# Altium schematic sheet Ethernet_part.SchDoc
size A4; SheetNumber: 2; SheetTotal: 3
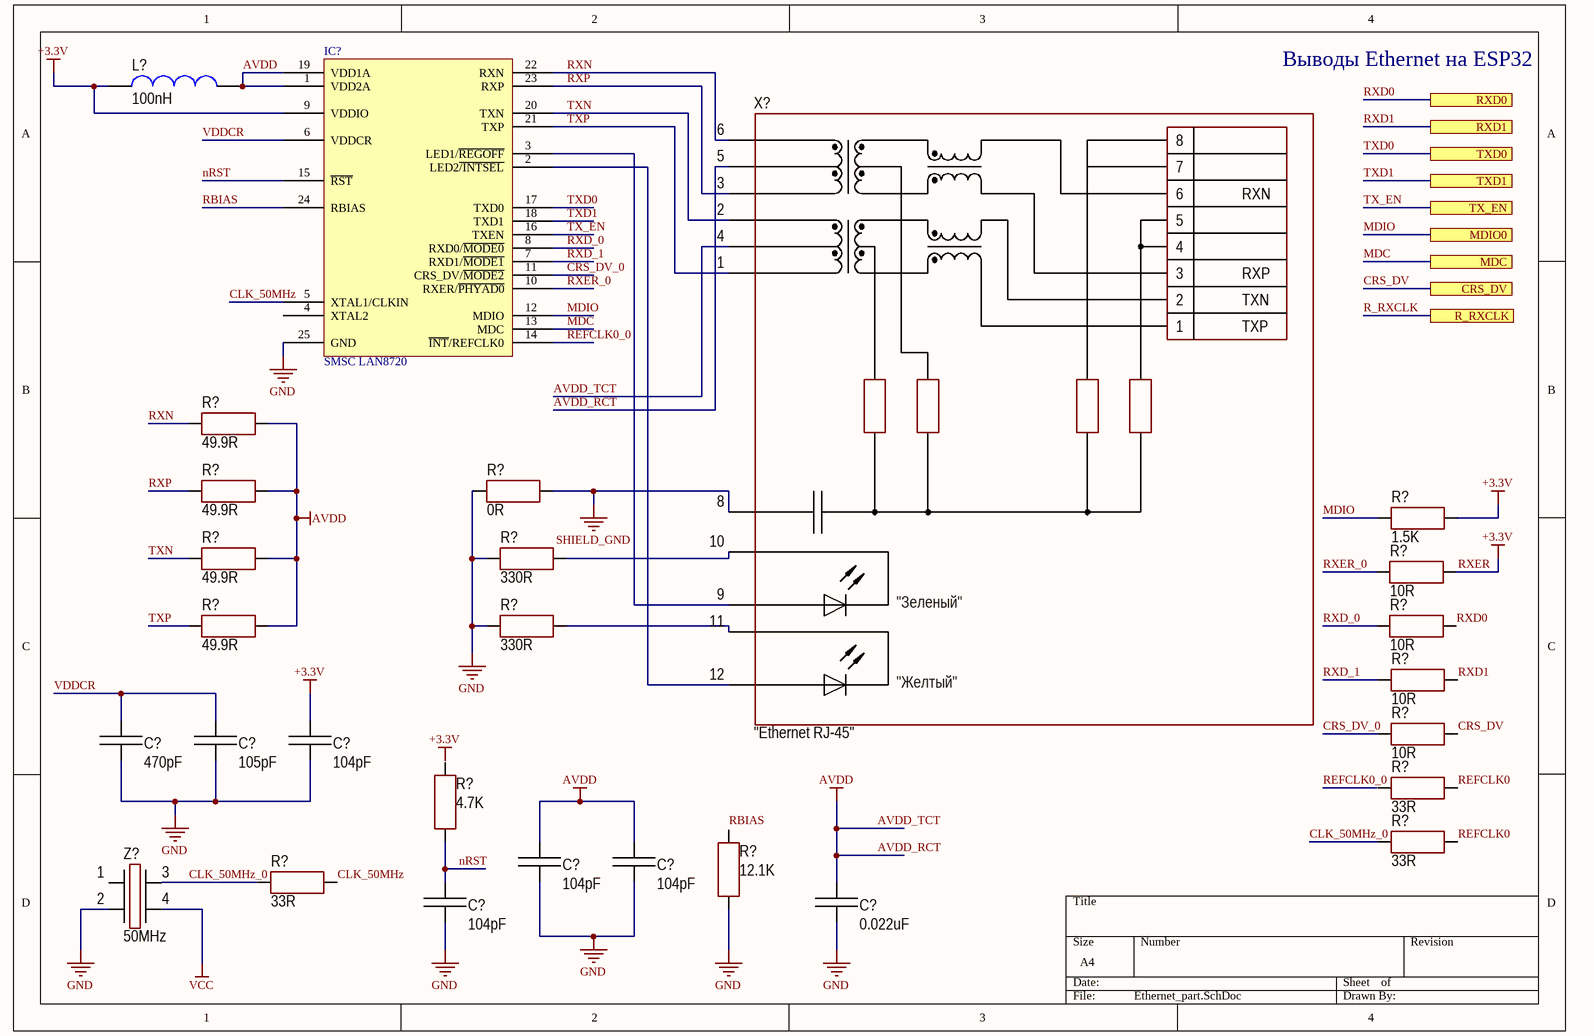
[diagram p0: Ethernet_part.SchDoc]

## Parts
(Parts that share a designator on the sheet are numbered #1, #2 ... from top to bottom, then left to right.)
C?#1  value 470pF  [CAP: 0402]
C?#2  value 105pF  [CAP: 0402]
C?#3  value 104pF  [CAP: 0402]
C?#4  value 104pF  [CAP: 0402]
C?#5  value 104pF  [CAP: 0402]
C?#6  value 104pF  [CAP: 0402]
C?#7  value 0.022uF  [CAP: 0402]
IC?  SMSC LAN8720  [MICROCHIP QFN-24 4x4]
L?  value 100nH  [IND: 0402]
R?#1  value 49.9R  [RES: 0402]
R?#2  value 49.9R  [RES: 0402]
R?#3  value 0R  [RES: 0402]
R?#4  value 1.5K  [RES: 0402]
R?#5  value 49.9R  [RES: 0402]
R?#6  value 330R  [RES: 0402]
R?#7  value 10R  [RES: 0402]
R?#8  value 49.9R  [RES: 0402]
R?#9  value 330R  [RES: 0402]
R?#10  value 10R  [RES: 0402]
R?#11  value 10R  [RES: 0402]
R?#12  value 10R  [RES: 0402]
R?#13  value 4.7K  [RES: 0402]
R?#14  value 33R  [RES: 0402]
R?#15  value 12.1K  [RES: 0402]
R?#16  value 33R  [RES: 0402]
R?#17  value 33R  [RES: 0402]
X?  CommentText: "Ethernet RJ-45"  [CON: HR911105A]
Z?  Frequency: 50MHz  [OSC: 3225]

## Ports
CRS_DV (see esp_part[6D]), MDC (see esp_part[6D]), MDIO0 (see esp_part[6D]), R_RXCLK (see esp_part[6D]), RXD0 (see esp_part[6C]), RXD1 (see esp_part[6C]), TX_EN (see esp_part[6D]), TXD0 (see esp_part[6C]), TXD1 (see esp_part[6D])

## Nets
AVDD: C?#4.2 C?#5.2 C?#7.2 IC?.1(VDD2A) IC?.19(VDD1A) L?.1 R?#1.1 R?#2.1 R?#5.1 R?#8.1 X?.4(CT) X?.5(CT)  [also labelled AVDD_RCT, AVDD_TCT]
GND: C?#3.1 C?#5.1 C?#7.1 IC?.25(GND) R?#3.1 R?#6.1 R?#9.1 R?#15.2 Z?.2
RXER: C?#3.2 IC?.9(VDDIO) L?.2 R?#4.1 R?#7.1  [also labelled +3.3V]
SHIELD_GND: R?#3.2 X?.8(GND)
VCC: Z?.4
CLK_50MHz: IC?.5(XTAL1/CLKIN) R?#17.2
CLK_50MHz_0: R?#16.2 R?#17.1 Z?.3
CRS_DV: R?#12.1 ; port CRS_DV
CRS_DV_0: IC?.11(CRS_DV/~{MODE2}) R?#12.2
MDC: IC?.13(MDC) ; port MDC
MDIO: IC?.12(MDIO) R?#4.2 ; port MDIO0
nRST: C?#6.2 IC?.15(~{RST}) R?#13.2
R_RXCLK: port R_RXCLK
RBIAS: IC?.24(RBIAS)
REFCLK0: R?#14.1 R?#16.1
REFCLK0_0: IC?.14(~{INT}/REFCLK0)
RXD0: R?#10.1 ; port RXD0
RXD1: R?#11.1 ; port RXD1
RXD_0: IC?.8(RXD0/~{MODE0}) R?#10.2
RXD_1: IC?.7(RXD1/~{MODE1}) R?#11.2
RXER_0: IC?.10(RXER/~{PHYAD0}) R?#7.2
RXN: IC?.22(RXN) R?#1.2 X?.6(RD-)
RXP: IC?.23(RXP) R?#2.2 X?.3(RD+)
TX_EN: IC?.16(TXEN) ; port TX_EN
TXD0: IC?.17(TXD0) ; port TXD0
TXD1: IC?.18(TXD1) ; port TXD1
TXN: IC?.20(TXN) R?#5.2 X?.2(TD-)
TXP: IC?.21(TXP) R?#8.2 X?.1(TD+)
VDDCR: C?#1.2 C?#2.2 IC?.6(VDDCR)
NetIC?_2: IC?.2(LED2~{/INTSEL}) X?.12(D4)
NetIC?_3: IC?.3(LED1/~{REGOFF}) X?.9(D2)
NetR?#6_2: R?#6.2 X?.10(D1)
NetR?#9_2: R?#9.2 X?.11(D3)

Not connected (* = marked no-connect by the designer): C?#1 1; C?#2 1; C?#4 1; C?#6 1; IC? 4(XTAL2); R?#13 1; R?#14 2; R?#15 1; Z? 1

## Notes on the sheet
- Выводы Ethernet на ESP32
- Labels drawn without touching a wire or pin: +3.3V, RBIAS
- (in symbol Connector_HR911105A) 7; RXN; RXP; TXN; TXP; "Зеленый"; "Желтый"

## Library data of the parts
C?#1 = Ceramic_0402: Manufacturer: Yageo; PartNumber: CC0402KRX7R7BB104; ValueManufacturerPartNumber: Ceramic capacitor, 470pF, X7R, ±10%, 16V, 0402, -55...+125°C; TypeCapacitor: Ceramic capacitor; Tolerance: ±10%; TypeDielectric: X7R; Voltage: 16V; Package: 0402; HelpURL: https://www.digikey.com/product-detail/en/yageo/CC0402KRX7R7BB104/311-1338-1-ND/2103122; Temperature: -55...+125°C
C?#2 = Ceramic_0402: Manufacturer: Yageo; PartNumber: CC0402KRX7R7BB104; ValueManufacturerPartNumber: Ceramic capacitor, 105pF, X7R, ±10%, 16V, 0402, -55...+125°C; TypeCapacitor: Ceramic capacitor; Tolerance: ±10%; TypeDielectric: X7R; Voltage: 16V; Package: 0402; HelpURL: https://www.digikey.com/product-detail/en/yageo/CC0402KRX7R7BB104/311-1338-1-ND/2103122; Temperature: -55...+125°C
C?#3-C?#6 = Ceramic_0402: Manufacturer: Yageo; PartNumber: CC0402KRX7R7BB104; ValueManufacturerPartNumber: Ceramic capacitor, 104pF, X7R, ±10%, 16V, 0402, -55...+125°C; TypeCapacitor: Ceramic capacitor; Tolerance: ±10%; TypeDielectric: X7R; Voltage: 16V; Package: 0402; HelpURL: https://www.digikey.com/product-detail/en/yageo/CC0402KRX7R7BB104/311-1338-1-ND/2103122; Temperature: -55...+125°C
C?#7 = Ceramic_0402: Manufacturer: Yageo; PartNumber: CC0402KRX7R7BB104; ValueManufacturerPartNumber: Ceramic capacitor, 0.022uF, X7R, ±10%, 16V, 0402, -55...+125°C; TypeCapacitor: Ceramic capacitor; Tolerance: ±10%; TypeDielectric: X7R; Voltage: 16V; Package: 0402; HelpURL: https://www.digikey.com/product-detail/en/yageo/CC0402KRX7R7BB104/311-1338-1-ND/2103122; Temperature: -55...+125°C
IC? = SMSC LAN8720: Small Footprint RMII 10/100 Ethernet  Transceiver with HP Auto-MDIX Support
L? = Inductor_0402: Manufacturer: Murata Electronics; PartNumber: LQG15HSR10J02D; ValueManufacturerPartNumber: Fixed inductor, 100nH, ±5%, 0402, 200mA, -55...+125°C; TypeInductor: Fixed inductor; MaxCurrent: 200mA; Tolerance: ±5%; Package: 0402; HelpURL: https://www.digikey.com/product-detail/en/murata-electronics-north-america/LQG15HSR10J02D/490-2635-1-ND/662915; Temperature: -55...+125°C
R?#1 R?#2 R?#5 R?#8 = Resistor_0402: Manufacturer: Yageo; PartNumber: RC0402JR-07100RL; ValueManufacturerPartNumber: Resistor film, 49.9R, ±5%, 0402, 0.063W, -55...+125°C; TypeResistor: Resistor film; Power: 0.063W; Tolerance: ±5%; Package: 0402; HelpURL: https://www.digikey.com/product-detail/en/yageo/RC0402JR-07100RL/311-100JRCT-ND/729362; Temperature: -55...+125°C
R?#3 = Resistor_0402: Manufacturer: Yageo; PartNumber: RC0402JR-07100RL; ValueManufacturerPartNumber: Resistor film, 0R, ±5%, 0402, 0.063W, -55...+125°C; TypeResistor: Resistor film; Power: 0.063W; Tolerance: ±5%; Package: 0402; HelpURL: https://www.digikey.com/product-detail/en/yageo/RC0402JR-07100RL/311-100JRCT-ND/729362; Temperature: -55...+125°C
R?#4 = Resistor_0402: Manufacturer: Yageo; PartNumber: RC0402JR-07100RL; ValueManufacturerPartNumber: Resistor film, 1.5K, ±5%, 0402, 0.063W, -55...+125°C; TypeResistor: Resistor film; Power: 0.063W; Tolerance: ±5%; Package: 0402; HelpURL: https://www.digikey.com/product-detail/en/yageo/RC0402JR-07100RL/311-100JRCT-ND/729362; Temperature: -55...+125°C
R?#6 R?#9 = Resistor_0402: Manufacturer: Yageo; PartNumber: RC0402JR-07100RL; ValueManufacturerPartNumber: Resistor film, 330R, ±5%, 0402, 0.063W, -55...+125°C; TypeResistor: Resistor film; Power: 0.063W; Tolerance: ±5%; Package: 0402; HelpURL: https://www.digikey.com/product-detail/en/yageo/RC0402JR-07100RL/311-100JRCT-ND/729362; Temperature: -55...+125°C
R?#7 R?#10-R?#12 = Resistor_0402: Manufacturer: Yageo; PartNumber: RC0402JR-07100RL; ValueManufacturerPartNumber: Resistor film, 10R, ±5%, 0402, 0.063W, -55...+125°C; TypeResistor: Resistor film; Power: 0.063W; Tolerance: ±5%; Package: 0402; HelpURL: https://www.digikey.com/product-detail/en/yageo/RC0402JR-07100RL/311-100JRCT-ND/729362; Temperature: -55...+125°C
R?#13 = Resistor_0402: Manufacturer: Yageo; PartNumber: RC0402JR-07100RL; ValueManufacturerPartNumber: Resistor film, 4.7K, ±5%, 0402, 0.063W, -55...+125°C; TypeResistor: Resistor film; Power: 0.063W; Tolerance: ±5%; Package: 0402; HelpURL: https://www.digikey.com/product-detail/en/yageo/RC0402JR-07100RL/311-100JRCT-ND/729362; Temperature: -55...+125°C
R?#14 R?#16 R?#17 = Resistor_0402: Manufacturer: Yageo; PartNumber: RC0402JR-07100RL; ValueManufacturerPartNumber: Resistor film, 33R, ±5%, 0402, 0.063W, -55...+125°C; TypeResistor: Resistor film; Power: 0.063W; Tolerance: ±5%; Package: 0402; HelpURL: https://www.digikey.com/product-detail/en/yageo/RC0402JR-07100RL/311-100JRCT-ND/729362; Temperature: -55...+125°C
R?#15 = Resistor_0402: Manufacturer: Yageo; PartNumber: RC0402JR-07100RL; ValueManufacturerPartNumber: Resistor film, 12.1K, ±5%, 0402, 0.063W, -55...+125°C; TypeResistor: Resistor film; Power: 0.063W; Tolerance: ±5%; Package: 0402; HelpURL: https://www.digikey.com/product-detail/en/yageo/RC0402JR-07100RL/311-100JRCT-ND/729362; Temperature: -55...+125°C
X? = Connector_HR911105A: Manufacturer: Hanrun; ValueManufacturerPartNumber: Etherner RJ-45 connector; HelpURL: https://ru.aliexpress.com/item/32244614847.html?spm=a2g0v.search0104.3.9.304d24e7qb4B5g&ws_ab_test=searchweb0_0%2Csearchweb201602_10_10065_10068_319_317_10696_453_10084_454_10083_10618_10307_10301_537_536_10059_10884_10887_321_322_10915_10103_10914_10911_10910%2Csearchweb201603_52%2CppcSwitch_0&algo_expid=ad591376-da58-472d-83c6-21bacd43ef2b-1&algo_pvid=ad591376-da58-472d-83c6-21bacd43ef2b&transAbTest=ae803_5; TypeConnector: Etherner RJ-45 connector; PartNumber: HR911105A
Z? = Crystal_3225: Manufacturer: Diodes Incorporated; PartNumber: FL1000002; ValueManufacturerPartNumber: Crystal, 50MHz, 12pF, ±25ppm, case 3225, -40...+85°C; LoadCapacitance: 12pF; Tolerance: ±25ppm; Package: case 3225; HelpURL: https://www.digikey.com/product-detail/en/diodes-incorporated/FL1000002/FL1000002CT-ND/6042078; Temperature: -40...+85°C; TypeOscilator: Crystal